# EasyEDA Pro project FKM3.epro, board FKM_PCB
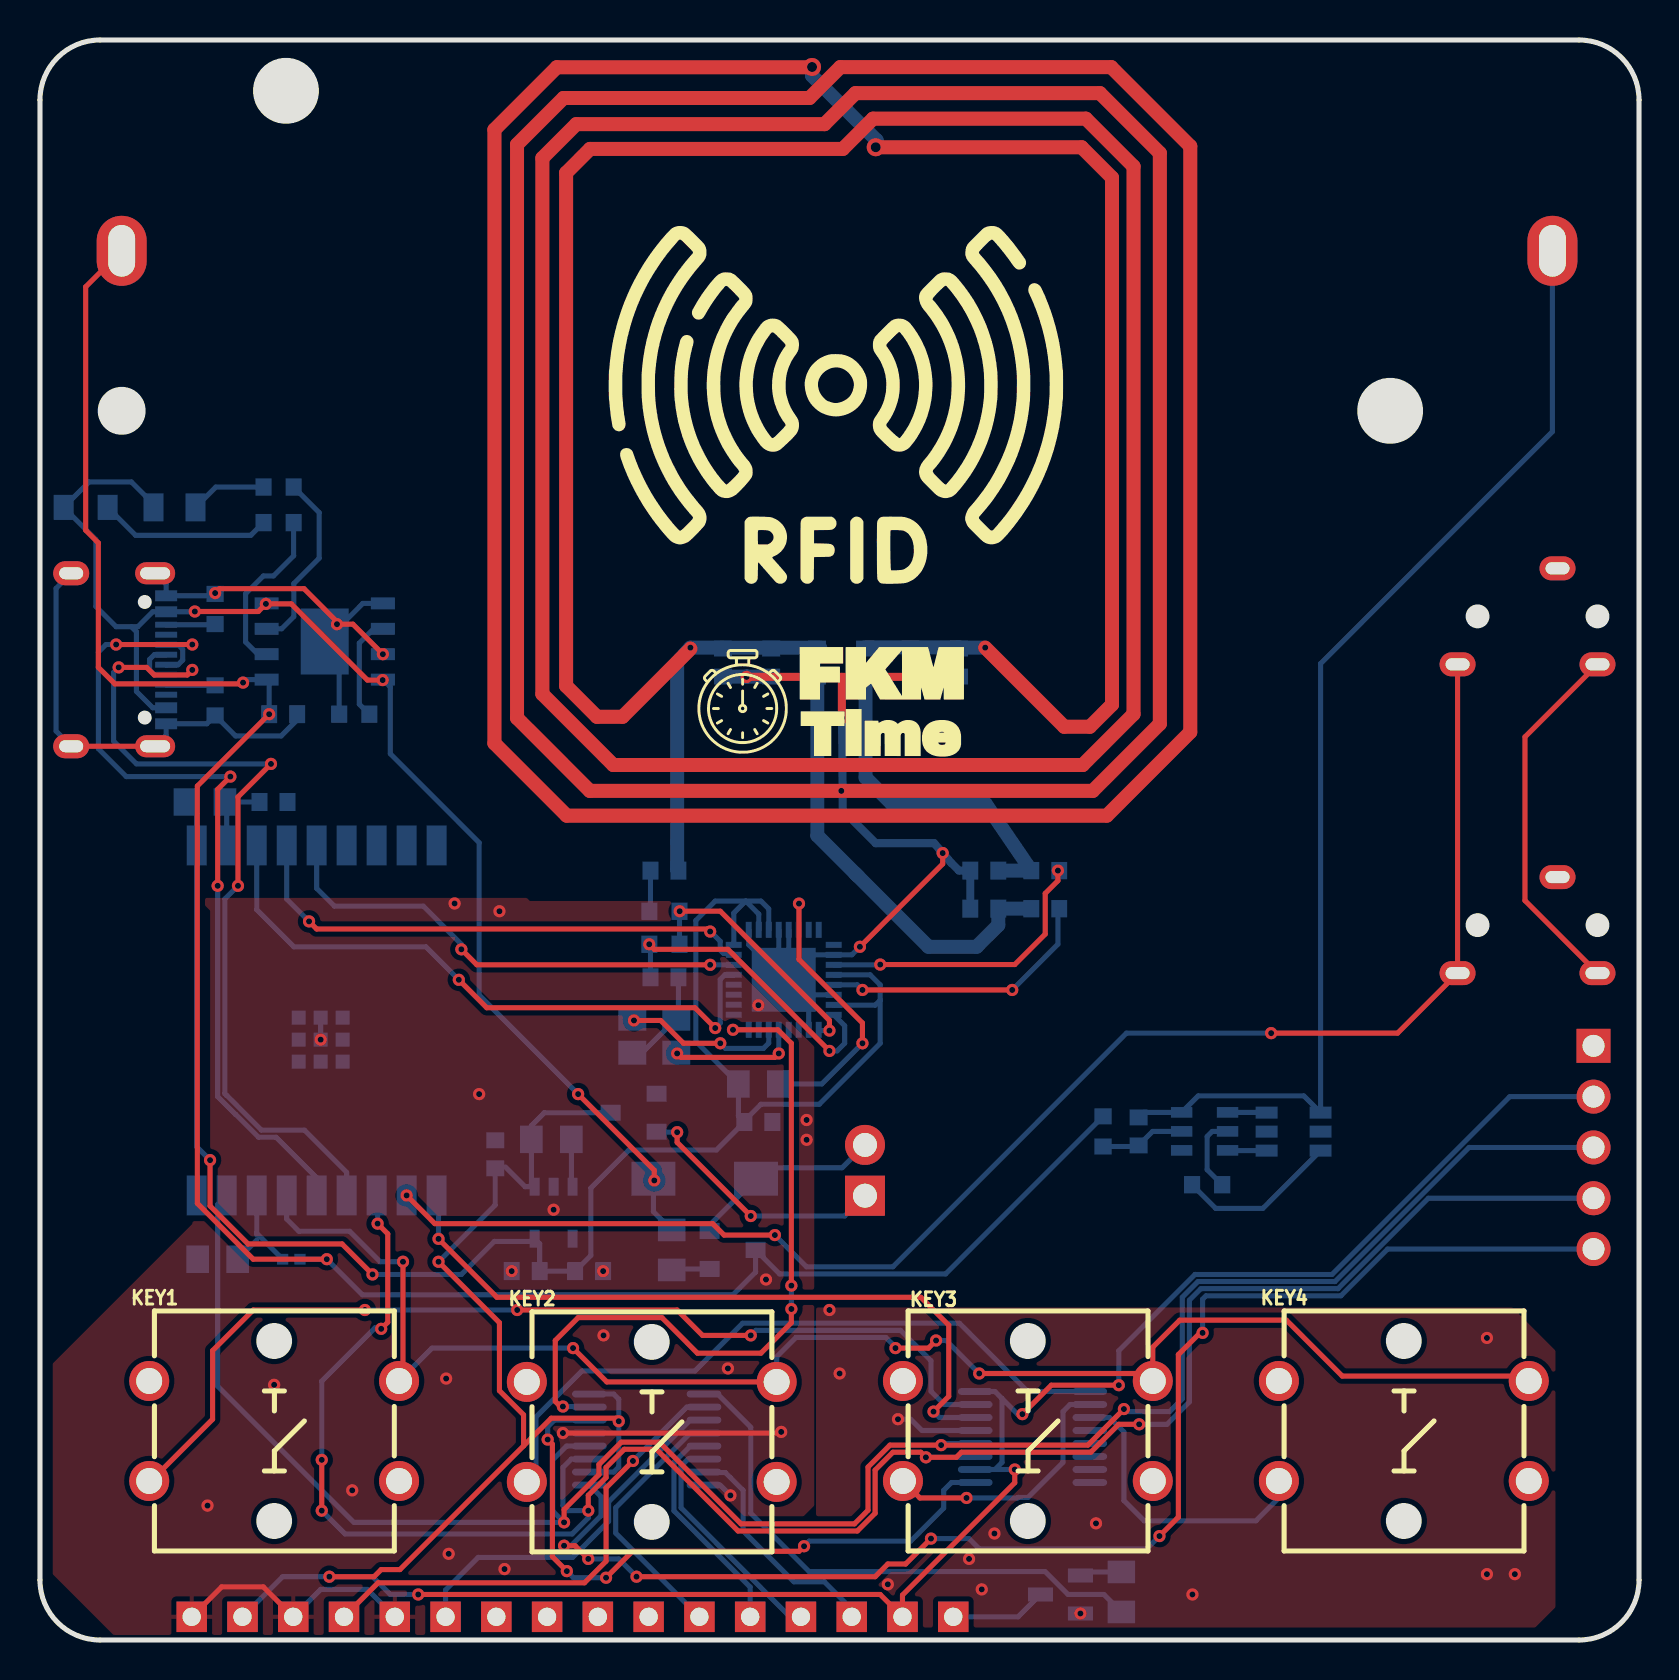
[diagram p19: board, top side]
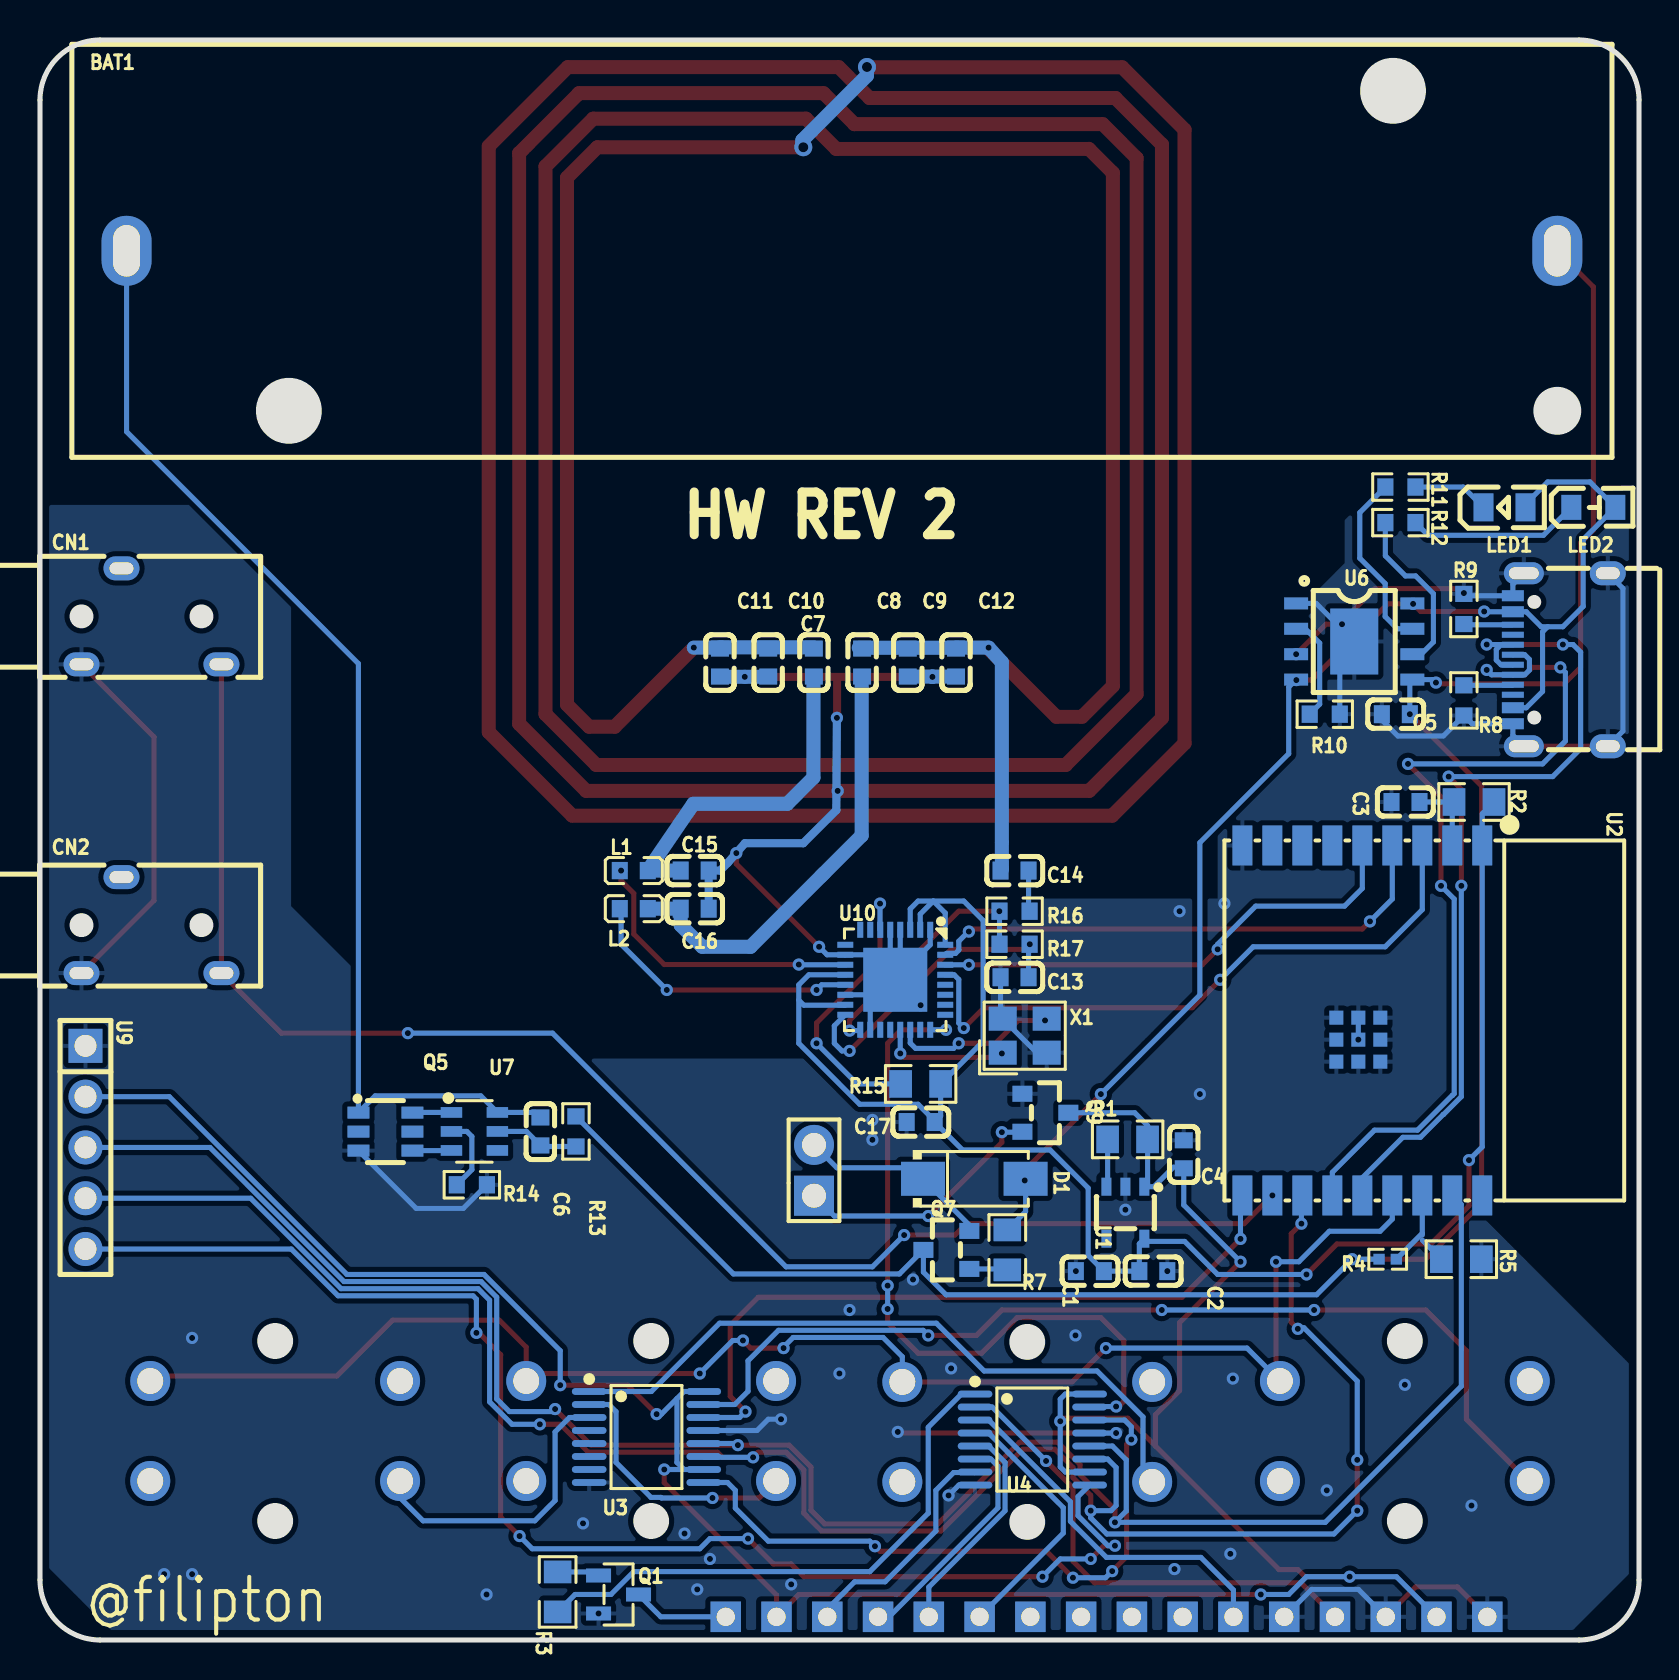
[diagram p20: board, bottom side, seen from below]

Outline 80 x 80 mm; copper layers: Top Layer, Bottom Layer. Coordinates in mm from the lower left corner of the outline.
Outline path: 0,77 0,3 arc(0.88,0.88) 3,0 77,0 arc(79.12,0.88) 80,3 80,77 arc(79.12,79.12) 77,80 3,80 arc(0.88,79.12) 0,77
Stack: Top Layer 0.035mm / Dielectric1 1.51mm FR4 er 4.5 / Bottom Layer 0.035mm

## Design rules (mm)
template: JLCPCB Capability(Two Layers Board)
spacing copperThickness1oz (default): track to track 0.102, other pairs 0.152 to 0.3
spacing copperThickness2oz: track to track 0.203, other pairs 0.152 to 0.3
track width copperThickness1oz (default): min 0.127, default 0.254, max 2.54
track width copperThickness2oz: min 0.203, default 0.254, max 2.54
differential pair differentialPair (default): width min 0.127, default 0.254, max 2.54; gap min 0.152, default 0.152
via viaSize (default): diameter min 0.5, default 0.61, max 10; hole min 0.3, default 0.305, max 6.3

## Placement (name value [footprint] x y rotation side)
BAT1  BH-18650-A6AJ003  [BAT-TH_BH-18650-A5BJ003]  39.88 69.46 180 bottom
C1  10uF  [C0603]  27.48 18.44 0 bottom
C2  100nF  [C0603]  24.3 18.44 180 bottom
C3  1uF  [C0603]  11.68 41.9 180 bottom
C4  10uF  [C0603]  22.78 24.29 90 bottom
C5  10uF  [C0603]  12.17 46.29 180 bottom
C6  100nF  [C0603]  54.96 25.43 90 bottom
C7  15pF  [C0603]  41.28 48.87 90 bottom
C8  15pF  [C0603]  38.87 48.87 90 bottom
C9  180pF  [C0603]  36.58 48.87 270 bottom
C10  180pF  [C0603]  43.57 48.87 270 bottom
C11  10pF  [C0603]  45.98 48.87 270 bottom
C12  10pF  [C0603]  34.17 48.87 270 bottom
C13  100nF  [C0603]  31.24 33.14 0 bottom
C14  100nF  [C0603]  31.24 38.47 0 bottom
C15  47pF  [C0603]  47.24 38.47 180 bottom
C16  47pF  [C0603]  47.24 36.57 0 bottom
C17  100nF  [C0603]  35.94 25.9 0 bottom
CN1  PJ-3200  [AUDIO-TH_PJ-3200]  74.42 51.18 180 bottom
CN2  PJ-3200  [AUDIO-TH_PJ-3200]  74.42 35.74 180 bottom
D1  SS14  [SMA_L4.2-W2.6-LS5.3-RD]  33.26 23.06 180 bottom
H1  -  [LCD16x2 edge connector]  7.59 1.16 0 top
H4  PW  [HDR-TH_2P-P2.54-V-M]  41.27 23.49 90 bottom
KEY1  B3F-4055  [KEY-TH_4P-L12.0-W12.0-P5.00-LS13.4-EH]  11.72 10.45 0 top
KEY2  B3F-4055  [KEY-TH_4P-L12.0-W12.0-P5.00-LS13.4-EH]  30.61 10.4 0 top
KEY3  B3F-4055  [KEY-TH_4P-L12.0-W12.0-P5.00-LS13.4-EH]  49.42 10.45 0 top
KEY4  B3F-4055  [KEY-TH_4P-L12.0-W12.0-P5.00-LS13.4-EH]  68.23 10.45 0 top
L1  2.2uH  [L0603]  50.29 38.47 180 bottom
L2  2.2uH  [L0603]  50.29 36.57 180 bottom
LED1  KT-0805G  [LED0805-R-RD]  6.73 56.63 180 bottom
LED2  LTST-C170TBKT  [LED0805-RD_BLUE]  2.29 56.63 180 bottom
Q1  MMBT3904  [SOT-23-3_L2.9-W1.3-P1.90-LS2.4-BR]  51.05 2.28 0 bottom
Q5  FS8205A  [SOT-23-6_L2.9-W1.6-P0.95-LS2.8-BR]  62.72 25.42 0 bottom
Q7  AO3401A  [SOT-23_L2.9-W1.3-P1.90-LS2.4-BR]  34.65 19.5 180 bottom
Q9  AO3401A  [SOT-23_L2.9-W1.3-P1.90-LS2.4-BR]  29.7 26.36 0 bottom
R1  10kΩ  [R0805]  25.59 25.03 180 bottom
R2  10kΩ  [R0805]  8.25 41.9 0 bottom
R3  10kΩ  [R0805]  54.1 2.4 90 bottom
R4  6.8kΩ  [R0402]  12.57 19.04 180 bottom
R5  10kΩ  [R0805]  8.89 19.04 180 bottom
R7  10kΩ  [R0805]  31.6 19.5 270 bottom
R8  5100  [R0603]  8.76 46.98 90 bottom
R9  5100  [R0603]  8.76 51.55 270 bottom
R10  1.2k  [R0603]  15.72 46.29 180 bottom
R11  1k  [R0603]  11.94 57.65 0 bottom
R12  1k  [R0603]  11.94 55.87 0 bottom
R13  100  [R0603]  53.19 25.43 90 bottom
R14  1k  [R0603]  58.39 22.76 0 bottom
R15  10kΩ  [R0805]  35.94 27.8 0 bottom
R16  5.1kΩ  [R0603]  31.24 36.44 180 bottom
R17  820Ω  [R0603]  31.24 34.79 0 bottom
U1  AP7366-33W5-7  [SOT-25_L3.0-W1.6-P0.95-LS2.8-BL]  25.7 21.37 0 bottom
U2  2.4GHz  [BULETM-SMD_ESPRESSIF_ESP32-C3-WROOM-02-N4-4MB]  13.84 30.98 270 bottom
U3  74HC595PW,118  [TSSOP-16_L5.0-W4.4-P0.65-LS6.4-BL]  49.66 10.15 270 bottom
U4  74HC595PW,118  [TSSOP-16_L5.0-W4.4-P0.65-LS6.4-BL]  30.35 10.02 270 bottom
U6  TP4056  [ESOP-8_L4.9-W3.9-P1.27-LS6.0-BL-EP]  14.25 49.93 270 bottom
U7  DW01A  [SOT-23-6_L2.9-W1.6-P0.95-LS2.8-BL]  58.27 25.43 270 bottom
U9  HB-PH3-25415PB2GOP  [HDR-TH_5P-P2.54-V-M]  77.72 24.63 270 bottom
U10  13.56MHz  [QFN-32_L5.0-W5.0-P0.50-TL-EP3.1]  37.21 33.01 270 bottom
USB1  TYPE-C 16PIN 2MD(073)  [USB-C-SMD_TYPE-C-6PIN-2MD-073]  3.94 49.01 90 bottom
X1  27.12MHz  [CRYSTAL-SMD_4P-L3.2-W2.5-BL]  30.73 30.22 180 bottom

## Footprints (pads in the part's own frame, mm; a bottom-side part is the same pattern mirrored in y, then rotated)
AUDIO-TH_PJ-3200
  oval 1.8x1.2 hole 1.2x0.6: 2(-1.5,2.4) 3(-3.5,-2.4) 4(3.5,-2.4)
BAT-TH_BH-18650-A5BJ003
  oval 2.5x3.5 hole 1.34x2.58: 1(-35.79,0) 2(35.79,0)
BULETM-SMD_ESPRESSIF_ESP32-C3-WROOM-02-N4-4MB
  rect 2x1 smd: 1(-8.75,6) 2(-8.75,4.5) 3(-8.75,3) 4(-8.75,1.5) 5(-8.75,0) 6(-8.75,-1.5) 7(-8.75,-3) 8(-8.75,-4.5) 9(-8.75,-6) 10(8.75,-6) 11(8.75,-4.5) 12(8.75,-3) 13(8.75,-1.5) 14(8.75,0) 15(8.75,1.5) 16(8.75,3) 17(8.75,4.5) 18(8.75,6)
  rect 0.7x0.7 smd: 19(-0.14,-1.3) 19(-0.14,-0.2) 19(-0.14,0.9) 19(0.96,-1.3) 19(0.96,-0.2) 19(0.96,0.9) 19(2.06,-1.3) 19(2.06,-0.2) 19(2.06,0.9)
C0603
  rect 0.8x0.9 smd: 1(-0.7,0) 2(0.7,0)
CRYSTAL-SMD_4P-L3.2-W2.5-BL
  rect 1.4x1.2 smd: 1(-1.1,-0.85) 2(1.1,-0.85) 3(1.1,0.85) 4(-1.1,0.85)
ESOP-8_L4.9-W3.9-P1.27-LS6.0-BL-EP
  rect 0.6x1.2 smd: 1(-1.905,-2.909) 2(-0.635,-2.909) 3(0.635,-2.909) 4(1.905,-2.909) 5(1.905,2.909) 6(0.635,2.909) 7(-0.635,2.909) 8(-1.905,2.909)
  rect 3.3x2.4 smd: 9(0,0)
HDR-TH_2P-P2.54-V-M
  rect 2x2 hole 1.2: 1(-1.27,0)
  round 2 hole 1.2: 2(1.27,0)
HDR-TH_5P-P2.54-V-M
  rect 1.7x1.7 hole 1.1: 1(-5.08,0)
  round 1.7 hole 1.1: 2(-2.54,0) 3(0,0) 4(2.54,0) 5(5.08,0)
KEY-TH_4P-L12.0-W12.0-P5.00-LS13.4-EH
  round 2 hole 1.3: 1(6.25,-2.5) 2(-6.25,-2.5) 3(6.25,2.5) 4(-6.25,2.5)
L0603
  rect 0.8x0.864 smd: 1(-0.7,0) 2(0.7,0)
LCD16x2 edge connector
  rect 1.524x1.524 hole 0.914x0.914: 1(0,0) 3(5.08,0) 4(7.62,0) 5(10.16,0) 6(12.7,0) 7(15.24,0) 8(17.78,0) 9(20.32,0) 10(22.86,0) 11(25.4,0) 12(27.94,0) 13(30.48,0) 14(33.02,0) 15(35.56,0) 16(38.1,0)
  rect 1.524x1.524 hole 0.914x1: 2(2.54,0)
LED0805-R-RD
  rect 1x1.399 smd: 1(1.05,0) 2(-1.05,0)
LED0805-RD_BLUE
  rect 1x1.25 smd: 1(-1.1,0) 2(1.1,0)
QFN-32_L5.0-W5.0-P0.50-TL-EP3.1
  rect 0.8x0.3 smd: 1(-2.5,1.75) 2(-2.5,1.25) 3(-2.5,0.75) 4(-2.5,0.25) 5(-2.5,-0.25) 6(-2.5,-0.75) 7(-2.5,-1.25) 8(-2.5,-1.75) 17(2.5,-1.75) 18(2.5,-1.25) 19(2.5,-0.75) 20(2.5,-0.25) 21(2.5,0.25) 22(2.5,0.75) 23(2.5,1.25) 24(2.5,1.75)
  rect 0.3x0.8 smd: 9(-1.75,-2.5) 10(-1.25,-2.5) 11(-0.75,-2.5) 12(-0.25,-2.5) 13(0.25,-2.5) 14(0.75,-2.5) 15(1.25,-2.5) 16(1.75,-2.5) 25(1.75,2.5) 26(1.25,2.5) 27(0.75,2.5) 28(0.25,2.5) 29(-0.25,2.5) 30(-0.75,2.5) 31(-1.25,2.5) 32(-1.75,2.5)
  rect 3.2x3.2 smd: 33(0,0)
R0402
  rect 0.566x0.54 smd: 1(-0.433,0) 2(0.433,0)
R0603
  rect 0.806x0.864 smd: 1(-0.753,0) 2(0.753,0)
R0805
  rect 1.133x1.377 smd: 1(-1,0) 2(1,0)
SMA_L4.2-W2.6-LS5.3-RD
  rect 2.2x1.7 smd: 1(-2.566,0) 2(2.566,0)
SOT-23-3_L2.9-W1.3-P1.90-LS2.4-BR
  rect 1.25x0.7 smd: 1(1,-0.95) 2(1,0.95) 3(-1,0)
SOT-23-6_L2.9-W1.6-P0.95-LS2.8-BL
  rect 0.532x1.072 smd: 1(-0.95,-1.149) 2(0,-1.149) 3(0.95,-1.149) 4(0.95,1.149) 5(0,1.149) 6(-0.95,1.149)
SOT-23-6_L2.9-W1.6-P0.95-LS2.8-BR
  rect 1.1x0.6 smd: 1(1.35,-0.95) 2(1.35,0) 3(1.35,0.95) 4(-1.35,0.95) 5(-1.35,0) 6(-1.35,-0.95)
SOT-23_L2.9-W1.3-P1.90-LS2.4-BR
  rect 1x0.8 smd: 1(1.15,-0.95) 2(1.15,0.95) 3(-1.15,0)
SOT-25_L3.0-W1.6-P0.95-LS2.8-BL
  rect 0.5x0.9 smd: 1(-0.95,-1.3) 2(0,-1.3) 3(0.95,-1.3) 4(0.95,1.3) 5(-0.95,1.3)
TSSOP-16_L5.0-W4.4-P0.65-LS6.4-BL
  oval 0.343x1.732 smd: 1(-2.275,-2.866) 2(-1.625,-2.866) 3(-0.975,-2.866) 4(-0.325,-2.866) 5(0.325,-2.866) 6(0.975,-2.866) 7(1.625,-2.866) 8(2.275,-2.866) 9(2.275,2.866) 10(1.625,2.866) 11(0.975,2.866) 12(0.325,2.866) 13(-0.325,2.866) 14(-0.975,2.866) 15(-1.625,2.866) 16(-2.275,2.866)
USB-C-SMD_TYPE-C-6PIN-2MD-073
  rect 0.55x1.1 smd: 1(-3.2,2.375) 2(-2.4,2.375) 11(2.4,2.375) 12(3.2,2.375)
  rect 0.3x1.1 smd: 3(-1.75,2.375) 4(-1.25,2.375) 5(-0.75,2.375) 6(-0.25,2.375) 7(0.25,2.375) 8(0.75,2.375) 9(1.25,2.375) 10(1.75,2.375)
  oval 1.2x1.8 hole 0.6x1.2: 13(-4.325,-2.375) 14(4.325,-2.375)
  oval 1.1x2 hole 0.6x1.5: 13(-4.325,1.825) 14(4.325,1.825)

## Nets
As in the schematic.

Pads without a net: CN1 2; CN2 2; H1 7 8 9 10; KEY1 1 4; KEY2 1 4; KEY3 1 4; KEY4 1 4; Q5 2 5; U1 4; U2 6 7 8 18; U3 4 5 6 7; U7 4; U10 7 8 9 19 20 23 25 26 27 28; USB1 3 9

## Via types
v1: diameter 0.61, hole 0.305, Top Layer to Bottom Layer, 132 vias
v2: diameter 0.9, hole 0.5, Top Layer to Bottom Layer, 2 vias

## Routing (per net, layer and track width the routed paths; a pad name or vN(x,y) marks a point on that pad's centre or on a via; arc(x,y) is an arc through that point)
GND: length 665.3
  Top Layer w0.254: v1(26.16,10.35) 37.03,10.35 v1(37.08,10.4) ; CN1.3 74.3,45.16 74.3,36.97 CN2.3 ; USB1.13 USB1.13 ; v1(45.16,39.35) 45.16,38.8 v1(41.02,34.66) ; H1.3 11.17,2.66 9.09,2.66 H1.1 ; v1(17.16,49.29) 15.66,50.79 v1(14.86,50.79) 14.86,50.92 13.21,52.57 8.98,52.57 v1(8.76,52.35)
  Top Layer w0.4: v1(44.74,48.16) 44.74,48.16 40.12,48.16 ; 40.12,48.16 v1(35.35,48.16) ; 40.12,48.16 40.12,46.12 v1(40.13,46.11)
  Top Layer w0.7: 38.5,78.64 25.86,78.64 22.74,75.52 22.74,44.84 26.35,41.22 53.37,41.22 57.55,45.39 57.55,74.69 53.59,78.64 40.04,78.64 38.5,77.1 26.19,77.1 23.87,74.77 23.87,46.1 27.51,42.46 52.67,42.46 56.03,45.81 56.03,74.34 53.03,77.34 40.8,77.34 39.25,75.79 26.83,75.79 25.14,74.1 25.14,47.3 28.68,43.75 52.17,43.75 54.71,46.29 54.71,73.68 52.32,76.07 41.68,76.07 40.17,74.55 27.52,74.55 26.32,73.36 26.32,47.7 27.86,46.16 29.15,46.16 32.54,49.56 ; 41.81,74.64 52.11,74.64 53.63,73.12 53.63,46.77 52.52,45.66 51.24,45.66 v1(47.29,49.62)
  Bottom Layer w0.254: H1.3 14.04,2.53 16.38,2.53 H1.5 ; 37.96,32.26 38.46,31.76 U10.18 ; 37.96,32.26 U10.33 ; 37.96,32.26 U10.14 ; U10.1 35.46,34.76 36.96,33.26 U10.4 ; USB1.13 6.31,45.24 USB1.1 8.35,45.81 R8.1 9.79,45.2 12.06,45.2 12.87,46 C5.1 ; R10.2 14.97,49.2 U6.9 16.15,51.83 U6.1 ; USB1.14 6.31,52.79 USB1.12 8.63,52.21 v1(8.76,52.35) ; v1(14.04,30.02) U2.19 ; USB1.13 0.8,45.44 0.8,52.58 USB1.14 ; C13.2 31.94,31.17 30.13,29.37 X1.2 ; Q5.3 61.18,21.58 58.82,21.58 R14.1 ; U3.13 44.12,10.48 43.56,11.04 v1(42.93,11.04) ; v1(34.54,7.23) 34.02,7.75 U4.8 ; U10.5 37.46,33.26 38.46,34.26 U10.10 40.62,34.26 v1(41.02,34.66) ; U4.13 v1(26.16,10.35)
  Bottom Layer w0.4: 45.59,38.85 45.97,38.47 C15.2 C16.1
  Bottom Layer w0.406: v1(40.13,46.11) 40.16,41.49 41.81,39.84 44.73,39.84 45.59,38.85
  Bottom Layer w0.699: v1(32.54,49.62) 31.88,48.89 31.88,39.91
  Bottom Layer w0.7: 38.63,78.62 38.63,78.22 41.86,74.99 41.86,74.62 ; C12.2 35.34,48.17 v1(35.35,48.16) 35.37,48.17 C9.2 ; v1(47.29,49.62) 46.03,49.62 C11.1 45.92,49.63 41.28,49.63 ; C11.2 45.97,48.16 v1(44.74,48.16) 43.58,48.16 C10.2 ; 39.04,49.61 34.21,49.61 C12.1 34.12,49.62 v1(32.54,49.62) ; 31.88,39.87 31.88,38.53 31.94,38.47
  vias: v1(8.38,6.72) v1(11.72,12.76) v1(15.62,7.48) v1(20.32,13.07) v1(20.45,4.31) v1(20.74,36.83) v1(21.97,27.3) v1(22.99,36.44) v1(23.24,3.55) v1(23.6,18.44) v1(25.7,21.51) v1(28.17,18.44) v1(28.19,15.23) v1(34.42,13.58) v1(35.94,31.74) v1(36.32,18.02) v1(38.35,26) v1(38.35,25.01) v1(39.5,16.5) v1(40,13.33) v1(40.09,42.46) v1(42.42,2.78) v1(46.48,4.05) v1(47.12,2.53) v1(47.75,5.32) v1(52.05,1.33) v1(52.83,5.83) v1(57.66,2.28) v1(72.39,15.1) v1(72.39,3.29) v1(73.79,3.29) v2(38.63,78.65) v2(41.81,74.64)
VBUS: length 139.4
  Top Layer w0.254: v1(14.48,3.17) 16.71,3.17 17.07,3.52 18.01,3.52 24.19,9.71 ; v1(28.96,10.94) 28.8,11.09 25.58,11.09 24.19,9.71 ; v1(49.15,11.29) 50.6,12.74 v1(53.97,12.74) ; v1(48.77,8.53) 48.77,7.86 43.15,2.25 H1.15 42.03,2.28 v1(18.92,2.28) ; 24.19,9.71 24.19,11.26 22.99,12.47 22.99,15.87 v1(19.94,18.91)
  Bottom Layer w0.254: 23.28,23.65 24.27,22.67 U1.1 24.59,22.83 R1.2 24.59,25.72 25.23,26.36 Q9.3 ; v1(19.94,18.91) 22.78,21.75 C4.1 ; 48.13,12.07 48.13,8.88 47.78,8.53 ; 48.13,12.07 48.91,11.29 v1(49.15,11.29) ; 48.13,12.07 47.78,12.43 U3.16 ; H1.2 12.14,3.17 v1(14.48,3.17) 16.64,3.17 17.53,2.28 v1(18.92,2.28) ; 47.78,8.53 v1(48.77,8.53) ; 47.78,8.53 U3.10 ; 27.49,12.3 28.7,12.3 28.96,12.04 v1(28.96,10.94) 28.96,8.65 28.7,8.4 U4.10 ; v1(53.97,12.74) 53.97,14.47 57.78,18.28 64.64,18.28 73.53,27.17 77.72,27.17
VCC: length 93
  Top Layer w0.254: v1(8.51,23.99) 8.51,21.7 10.41,19.8 15.11,19.8 v1(16.64,18.28)
  Bottom Layer w0.254: C17.1 34.94,26.2 R15.1 32.81,29.93 32.81,35.98 33.78,36.95 35.31,36.95 ; C17.1 35.24,25.96 36.07,26.79 38.99,26.79 42.04,29.84 42.04,31.99 ; C17.1 33.84,24.5 29.46,24.5 27.56,22.6 27.56,19.23 C1.1 C2.1 25,19.81 U1.5 24.61,19.93 22.73,19.93 21.08,18.28 v1(16.64,18.28) ; 35.31,36.95 36.07,36.95 36.46,36.55 U10.3 ; 35.31,36.95 34.71,36.35 U10.32 ; 35.31,36.95 35.96,36.29 U10.2 ; U10.12 41.53,33.26 42.04,32.76 42.04,31.99 ; v1(8.51,23.99) 7.84,24.66 U2.1 7.84,41.31 R2.1 ; U10.15 39.73,31.74 41.78,31.74 42.04,31.99
B+: length 112.3
  Top Layer w0.254: 4.09,69.46 2.29,67.66 2.29,55.49 2.92,54.85 2.92,48.63 3.75,47.81 10.1,47.81 v1(10.16,47.87) ; v1(14.35,19.04) 10.67,19.04 7.87,21.83 7.87,42.7 v1(11.47,46.29)
  Bottom Layer w0.254: R13.2 45.31,18.3 37,18.3 Q7.3 35.8,18.39 34.67,17.26 16.13,17.26 v1(14.35,19.04) R4.1 ; v1(11.47,46.29) 11.47,47.89 U6.5 10.31,48.02 v1(10.16,47.87)
B-: length 57.8
  Bottom Layer w0.254: BAT1.1 75.67,60.42 64.07,48.82 Q5.1 63.23,27.21 57.94,27.21 U7.6 55.21,26.38 C6.2
BAT_SENS: length 5.2
  Bottom Layer w0.254: 10.84,20.25 10.84,20.34 ; 10.84,20.34 U2.16 ; 10.84,20.34 R4.2 ; R5.1 10.84,19.99
BTN_1: length 49.9
  Top Layer w0.254: 5.47,7.95 5.55,7.95 8.64,11.04 8.64,14.47 10.67,16.5 v1(16.26,16.5) ; v1(35.56,15.23) 33.15,15.23 31.88,16.5 v1(23.88,16.5)
  Bottom Layer w0.254: v1(16.26,16.5) v1(23.88,16.5) ; v1(35.56,15.23) 35.81,15.48 43.05,15.48 44.58,13.96 44.58,12.44 45.24,11.78 U3.15
BTN_2: length 34.5
  Bottom Layer w0.254: 24.36,7.95 24.82,8.4 24.82,11.15 27.11,13.45 32.77,13.45 35.15,15.84 46,15.84 49.41,12.43 U3.1
BTN_3: length 13.1
  Top Layer w0.254: KEY3.2 44.02,7.1 v1(46.36,7.1)
  Bottom Layer w0.254: U3.2 51.54,11.78 51.18,11.42 51.18,8.88 49.43,7.13 48.94,7.13 48.91,7.1 v1(46.36,7.1)
BTN_4: length 14.9
  Bottom Layer w0.254: KEY4.2 61.98,7.11 60.83,5.96 55.24,5.96 54.23,6.98 54.23,10.4 53.51,11.12 U3.3
BTN_INP: length 78.2
  Top Layer w0.254: v1(26.67,14.6) 28.36,12.9 KEY2.3 ; v1(44.83,14.98) 44.45,14.6 v1(42.8,14.6) ; KEY1.3 18.16,13.15 v1(18.16,18.91) ; KEY4.3 74.24,13.2 65.15,13.2 62.36,15.99 57.02,15.99 55.67,14.64 KEY3.3 55.3,13.33 v1(46.99,13.33)
  Bottom Layer w0.254: KEY2.3 36.86,14.16 37.82,15.13 42.32,15.13 42.8,14.65 v1(42.8,14.6) ; KEY1.3 19.61,14.6 v1(26.67,14.6) ; U2.15 12.34,21.05 12.95,20.44 15.49,20.44 17.02,18.91 v1(18.16,18.91) ; v1(46.99,13.33) 45.34,14.98 v1(44.83,14.98)
JACK: length 75.6
  Top Layer w0.254: CN1.4 CN2.4 67.92,30.34 v1(61.59,30.34) ; v1(36.77,20.25) 34.23,20.25 33.65,20.82 19.75,20.82 v1(18.34,22.23)
  Bottom Layer w0.254: v1(36.77,20.25) 38.35,18.66 42.67,18.66 54.36,30.34 v1(61.59,30.34)
LCD_BL: length 27.9
  Bottom Layer w0.254: 33.22,12.3 33.9,12.3 35.56,10.64 35.56,6.34 38.48,3.42 50.29,3.42 51.43,2.28 53.23,2.28 R3.1
LCD_D4: length 13.2
  Bottom Layer w0.254: U4.4 32.54,10.35 28.8,6.61 28.8,5.35 H1.11
LCD_D5: length 11.1
  Bottom Layer w0.254: H1.12 35.53,2.65 31.72,6.46 31.72,8.88 32.54,9.7 U4.5
LCD_D6: length 11.6
  Bottom Layer w0.254: 33.22,9.05 32.43,9.05 32.07,8.7 32.07,6.61 37.52,1.16 H1.13
LCD_D7: length 11.8
  Bottom Layer w0.254: U4.7 33.24,8.37 34.29,8.37 35.18,7.48 35.18,5.45 37.72,2.91 39.24,2.91 40.61,1.54 H1.14
LCD_E: length 18.4
  Bottom Layer w0.254: U4.3 32.54,11 28.45,6.91 28.45,5.93 26.64,4.13 21.92,4.13 20.29,2.5 H1.6
LCD_RS: length 24.5
  Top Layer w0.254: H1.4 16.91,2.86 27.24,2.86 28.32,3.94 28.32,7.61 v1(29.67,8.95)
  Bottom Layer w0.254: U4.2 32.36,11.65 v1(29.67,8.95)
RST: length 14.7
  Top Layer w0.254: v1(41.15,29.84) 41.15,30.85 37.97,34.03 v1(37.97,36.82)
  Bottom Layer w0.254: v1(41.15,29.84) 39.12,27.8 R15.2 ; U10.6 37.97,35.52 v1(37.97,36.82)
RX: length 12.5
  Top Layer w0.254: v1(32,36.44) 34.04,36.44 39.5,30.98 v1(39.5,30.47)
  Bottom Layer w0.254: R16.1 R17.2 ; U10.17 39,30.47 v1(39.5,30.47)
S_DS: length 36.4
  Top Layer w0.254: v1(44.7,11.42) 45.47,12.18 45.47,15.74 44.07,17.14 22.86,17.14 v1(19.94,20.06)
  Bottom Layer w0.254: U3.14 45,11.12 v1(44.7,11.42) ; U2.10 19.94,22.13 v1(19.94,20.06)
S_OUT: length 69.3
  Top Layer w0.254: v1(58.17,15.36) 58.04,15.36 56.95,14.27 56.95,6.14 v1(56.01,5.2) ; v1(29.84,3.17) 41.78,3.17 42.42,3.8 43.31,3.8 v1(44.58,5.07) ; v1(27.43,4.05) 26.77,4.72 v1(26.22,4.72)
  Bottom Layer w0.254: U4.9 28.07,7.17 28.07,6.21 26.57,4.72 v1(26.22,4.72) ; U9.5 67.42,19.55 65.09,17.21 58.34,17.21 58.17,17.04 v1(58.17,15.36) ; v1(27.43,4.05) 28.96,4.05 v1(29.84,3.17) ; v1(44.58,5.07) 46.48,5.07 46.99,4.56 55.37,4.56 v1(56.01,5.2)
S_SHCP: length 104.7
  Top Layer w0.254: v1(27.43,6.47) 27.43,7.23 28.32,8.12 28.32,8.63 29.23,9.54 30.84,9.54 34.92,5.45 40.89,5.45 41.78,6.34 41.78,8.5 42.67,9.39 44.07,9.39 v1(44.32,9.13) 45.85,9.13 46.1,9.39 52.57,9.39 53.97,10.78 v1(54.99,10.78) ; v1(16.89,20.82) 17.4,20.31 17.4,15.89 v1(17.07,15.56) ; v1(14.1,6.47) v1(14.1,9.01)
  Bottom Layer w0.254: v1(14.1,6.47) 15.27,5.3 26.62,5.3 27.43,6.11 v1(27.43,6.47) 26.42,6.47 26.16,6.72 26.16,8.63 26.58,9.05 27.49,9.05 ; U3.11 46.75,9.13 v1(44.32,9.13) ; v1(54.99,10.78) 56.38,10.78 57.51,11.91 57.51,16.99 58.08,17.57 64.94,17.57 69.46,22.09 U9.4 ; v1(16.89,20.82) 16.89,22.18 U2.12 ; v1(14.1,9.01) 14.1,12.94 16.76,15.61 17.02,15.61 v1(17.07,15.56)
S_STCP: length 104.8
  Top Layer w0.254: v1(54.23,11.55) 52.43,9.74 v1(45.08,9.74) 42.52,9.74 41.43,8.65 41.43,6.49 40.75,5.81 35.07,5.81 30.99,9.89 29.08,9.89 27.96,8.77 27.96,8.27 26.22,6.53 v1(26.22,5.88)
  Bottom Layer w0.254: v1(54.23,11.55) 54.36,11.42 56.52,11.42 57.15,12.06 57.15,17.14 57.93,17.92 64.79,17.92 71.5,24.63 U9.3 ; v1(45.08,9.74) 45.17,9.83 U3.12 ; U2.17 8.89,21.78 8.89,12.69 15.7,5.88 v1(26.22,5.88) 25.65,6.45 25.65,9.01 26.34,9.7 U4.12
SPI_CS: length 36.5
  Top Layer w0.254: v1(34.67,30.51) 36.92,30.51 37.59,29.84 v1(37.59,17.72) ; v1(37.59,16.55) 37.59,15.87 36.07,14.34 32.89,14.34 31.11,16.12 26.92,16.12 25.78,14.98 25.78,11.93 26.03,11.67 v1(26.16,11.67)
  Bottom Layer w0.254: v1(26.16,11.67) 27.46,11.67 U4.15 ; v1(37.59,17.72) v1(37.59,16.55) ; U10.24 v1(34.67,30.51)
SPI_MISO: length 26.5
  Top Layer w0.254: v1(13.46,35.93) 13.84,35.55 33.4,35.55 v1(33.53,35.42)
  Bottom Layer w0.254: U2.4 12.34,37.05 v1(13.46,35.93) ; U10.31 34.64,34.33 34.2,34.33 34.03,34.49 34.03,34.94 33.55,35.42 v1(33.53,35.42)
SPI_MOSI: length 24.7
  Top Layer w0.254: v1(21.08,34.53) 21.86,33.76 v1(33.53,33.76)
  Bottom Layer w0.254: U10.30 v1(33.53,33.76) ; U2.5 13.84,37.58 14.73,36.69 19.18,36.69 21.08,34.79 v1(21.08,34.53)
SPI_SCK: length 31.9
  Top Layer w0.254: v1(20.95,33.01) 22.35,31.61 32.77,31.61 v1(33.78,30.6)
  Bottom Layer w0.254: v1(33.78,30.6) 34.03,30.85 34.03,33.03 34.27,33.26 U10.29 ; U2.3 10.84,36.52 12.7,34.66 19.3,34.66 v1(20.95,33.01)
TX1: length 14.7
  Top Layer w0.254: v1(42.04,33.77) 48.77,33.77 50.29,35.3 50.29,37.33 50.93,37.96 v1(50.93,38.47)
  Bottom Layer w0.254: v1(42.04,33.77) 42.02,33.76 U10.11
TX2: length 14.1
  Top Layer w0.254: v1(41.15,32.5) v1(48.64,32.5)
  Bottom Layer w0.254: v1(48.64,32.5) 50.93,34.79 50.93,36.5 L2.1 ; v1(41.15,32.5) 40.89,32.76 U10.13
USB_D+: length 44.3
  Top Layer w0.254: v1(3.81,49.77) v1(7.62,49.77) ; v1(9.52,43.17) 8.89,42.54 v1(8.89,37.71)
  Bottom Layer w0.254: v1(9.52,43.17) 4.32,43.17 2.92,44.57 2.92,49.39 3.3,49.77 v1(3.81,49.77) ; USB1.6 6.32,48.76 6.9,48.76 7.14,49 7.14,49.53 6.91,49.76 USB1.8 6.32,49.77 v1(7.62,49.77) ; v1(8.89,37.71) 8.89,27.17 9.78,26.28 9.79,26.28 10.93,25.14 11.81,25.14 13.84,23.11 U2.14
USB_D-: length 46.2
  Top Layer w0.254: v1(3.94,48.63) 5.33,48.63 5.71,48.25 7.37,48.25 v1(7.62,48.5) ; v1(11.56,43.81) 9.91,42.15 v1(9.91,37.71)
  Bottom Layer w0.254: U2.13 15.34,23.38 13.23,25.49 11.08,25.49 9.34,27.23 9.33,27.23 9.25,27.32 9.25,37.05 v1(9.91,37.71) ; v1(7.62,48.5) 7.38,48.26 USB1.5 5.72,48.26 5.48,48.5 5.48,49.03 5.72,49.27 6.31,49.27 USB1.7 ; v1(11.56,43.81) 4.83,43.81 3.68,44.95 3.68,48.38 v1(3.94,48.63)
VMID: length 15.5
  Top Layer w0.254: v1(39.5,29.45) 34.42,34.53 30.73,34.53 v1(30.48,34.79)
  Bottom Layer w0.254: C13.1 30.54,34.73 R17.1 ; v1(39.5,29.45) 39.88,29.45 40.26,29.84 40.26,30.71 U10.16
VUSB: length 66.9
  Top Layer w0.254: v1(26.92,27.3) 30.73,23.49 v1(30.73,22.98) ; v1(17.14,48) 16.38,48 12.57,51.81 v1(11.3,51.81) 10.92,51.43 v1(7.75,51.43)
  Bottom Layer w0.254: R7.1 30.69,21.42 D1.2 ; LED1.1 5.68,56.79 4.57,57.9 2.46,57.9 LED2.2 2.79,55.02 2.79,51.68 3.81,50.66 4.57,50.66 ; v1(26.92,27.3) 21.97,32.25 21.97,39.87 17.53,44.31 17.53,47.65 U6.4 ; 4.57,50.66 4.89,50.66 5.64,51.41 7.73,51.41 v1(7.75,51.43) ; 4.57,50.66 4.83,50.41 4.83,47.43 5.64,46.61 USB1.2
$1N383: length 2.4
  Bottom Layer w0.254: R1.1 26.59,22.73 U1.3
$1N953: length 3.9
  Bottom Layer w0.254: C3.2 R2.2 9.34,41.81 U2.2
$1N7305: length 32.9
  Top Layer w0.254: v1(25.4,10.02) 25.64,9.79 25.64,4.17 v1(26.36,3.44) ; v1(38.23,4.69) 37.97,4.44 29.64,4.44 v1(28.32,3.11)
  Bottom Layer w0.254: v1(38.23,4.69) 38.48,4.94 43.56,4.94 45.21,6.59 45.21,7.48 45.6,7.88 U3.9 ; v1(28.32,3.11) 26.69,3.11 v1(26.36,3.44) ; U4.14 25.74,11 25.4,10.66 v1(25.4,10.02)
$2N3153: length 2.1
  Bottom Layer w0.254: Q1.1 52.23,3.4 R3.2
$2N3159: length 4.8
  Bottom Layer w0.254: H1.16 48.94,1.16 Q1.3
$3N796: length 2.5
  Bottom Layer w0.254: USB1.10 8.73,50.76 R9.2
$3N800: length 2.5
  Bottom Layer w0.254: USB1.4 6.34,47.73 R8.2
$3N1470: length 4.2
  Bottom Layer w0.254: U7.5 55.66,25.43 C6.1 54.91,24.68 R13.1
$3N1480: length 9.1
  Bottom Layer w0.254: U6.7 12.09,50.56 12.7,51.17 12.7,52.82 13.97,54.09 13.97,56.37 R11.2
$3N1483: length 8.6
  Bottom Layer w0.254: U6.6 10.9,49.29 10.29,49.9 10.29,52.31 11.18,53.2 11.68,53.2 12.69,54.21 R12.2
$3N1491: length 5.2
  Bottom Layer w0.254: U6.2 16.69,50.56 15.98,49.85 15.98,46.79 R10.1
$3N1585: length 3.9
  Bottom Layer w0.254: U7.2 58.65,25.43 58.39,25.17 58.39,23.52 R14.2
$3N1604: length 2
  Bottom Layer w0.254: U7.3 59.42,24.47 61.37,24.47
$3N1608: length 2
  Bottom Layer w0.254: U7.1 61.36,26.38 61.37,26.37
$3N3082: length 3.8
  Bottom Layer w0.254: R11.1 8.8,57.65 LED1.2
$3N3173: length 8.6
  Bottom Layer w0.254: R12.1 10.55,55.24 4.78,55.24 LED2.1
$3N11361: length 9.7
  Bottom Layer w0.254: Q7.2 33.5,20.74 D1.1 36.37,23.61 40.13,23.61 H4.2
$3N11365: length 12.9
  Top Layer w0.254: v1(35.56,21.2) 31.88,24.88 v1(31.88,25.39)
  Bottom Layer w0.254: v1(31.88,25.39) 30.87,25.39 Q9.2 ; v1(35.56,21.2) 40.26,21.2 H4.1
$3N11375: length 1.9
  Bottom Layer w0.254: Q7.1 31.65,18.55 R7.2
$5N1067: length 6.4
  Top Layer w0.254: v1(31.88,29.33) 32.08,29.13 36.76,29.13 v1(36.96,29.33)
  Bottom Layer w0.254: U10.21 v1(36.96,29.33)
$5N1069: length 8.1
  Top Layer w0.254: v1(34.04,29.84) 32.2,29.84 31.05,30.98 v1(29.72,30.98)
  Bottom Layer w0.254: v1(34.04,29.84) 34.29,29.58 36.2,29.58 36.46,29.85 U10.22
$5N1072: length 2.1
  Bottom Layer w0.254: R16.2 30.54,36.49 C14.1
$5N1077: length 22.5
  Bottom Layer w0.699: 38.89,48.19 38.89,40.22 40.92,38.19
  Bottom Layer w0.7: 40.77,38.34 44.45,34.66 46.86,34.66 47.94,35.74 C16.2 L2.2
$5N1078: length 17.3
  Bottom Layer w0.699: 41.3,48.21 41.3,43.12 42.62,41.81 47.31,41.81 L1.2
  Bottom Layer w0.7: C15.1 L1.2

## Copper pours and planes (outline as drawn; the poured copper is in the pictures)
GND on Top Layer: 38.73,34.53 38.73,16.63 73.66,16.63 75.82,14.47 75.82,1.64 74.8,0.62 40.73,0.62 38.83,2.53 38.83,16.54 38.73,16.63 38.73,6.72 32.26,0.24 3.68,0.24 0.63,3.29 0.63,13.82 7.62,20.8 7.62,20.95 8.51,20.95 8.51,36.47 7.87,37.11 24.35,37.11 24.51,36.95 36.32,36.95
GND on Bottom Layer: 12.19,58.54 14.73,55.99 14.73,53.84 16.26,52.31 17.91,52.31 17.91,43.42 21.08,40.25 21.08,37.07 37.85,37.07 39.24,35.68 39.24,30.72 40.89,29.07 52.7,29.07 54.86,31.23 61.98,31.23 67.44,36.69 67.44,52.19 72.01,56.76 79.54,56.76 79.54,3.58 76.45,0.5 3.3,0.5 0.51,3.29 0.51,13.83 7.75,21.07 7.75,41.9 5.71,43.93 0.51,43.93 0.51,58.41 0.63,58.54

## Text on the board
Bottom Silkscreen Layer: @filipton | HW REV 2
